# EAGLE design SDISK2_V0.3 (EAGLE 7.6.0)
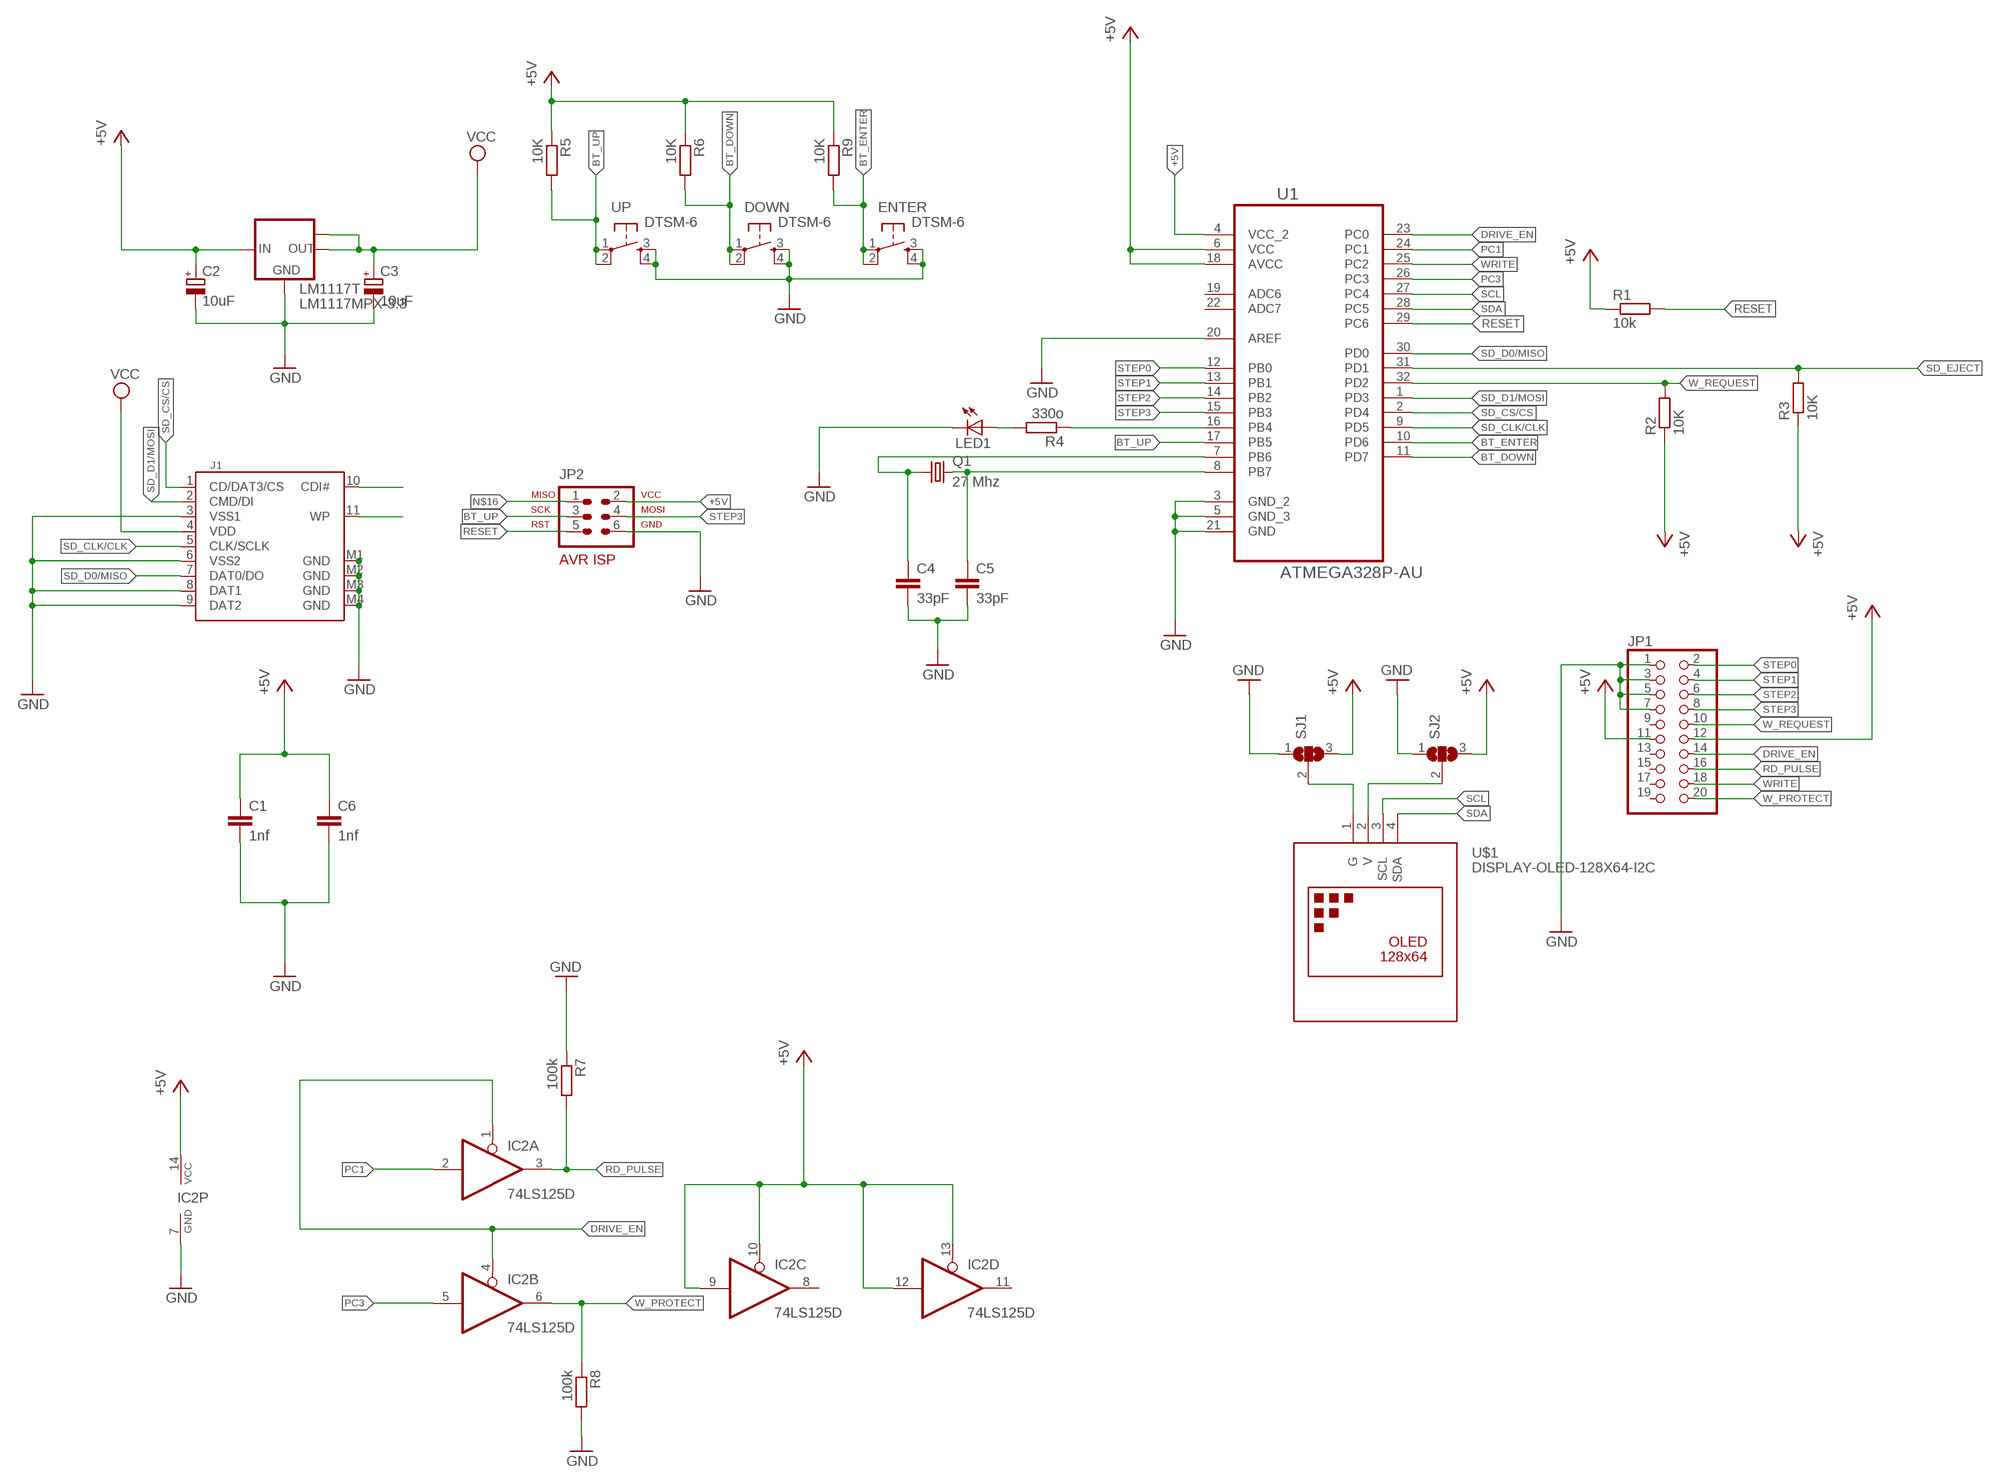
[diagram p0: schematic, sheet 1]

## Parts
C1  1nf  C-EUC0805  [C0805]
C2  10uF  CPOL-EU153CLV-0405  [153CLV-0405]
C3  10uF  CPOL-EU153CLV-0405  [153CLV-0405]
C4  33pF  C-EUC0805  [C0805]
C5  33pF  C-EUC0805  [C0805]
C6  1nf  C-EUC0805  [C0805]
DOWN  DTSM-6  [DTSM-6]
ENTER  DTSM-6  [DTSM-6]
IC2  74LS125D  [SO14]
J1  SDCARD  [SDCMF-10915W010]
JP1  PINHD-2X10_IDC2X10_IDC_NEW  [2X10_IDC]
JP2  AVR-ISP-6VERT  [AVR-ISP-6]
LED1  LEDSML1206  [SML1206]
LM1117T  LM1117MPX-3.3  [SOT223]
Q1  27 Mhz  CRYSTALHC49UP  [HC49UP]
R1  10k  R-EU_R0805  [R0805]
R2  10K  R-EU_R0805  [R0805]
R3  10K  R-EU_R0805  [R0805]
R4  330o  R-EU_R0805  [R0805]
R5  10K  R-EU_R0805  [R0805]
R6  10K  R-EU_R0805  [R0805]
R7  100k  R-EU_R0805  [R0805]
R8  100k  R-EU_R0805  [R0805]
R9  10K  R-EU_R0805  [R0805]
SJ1  SJ2W  [SJ_2]
SJ2  SJ2W  [SJ_2]
U1  ATMEGA328P-AU  [QFP80P900X900X120-32N]
U$1  DISPLAY-OLED-128X64-I2C  [DISPLAY-OLED-128X64-I2C]
UP  DTSM-6  [DTSM-6]

## Nets
3.3V: C3.+ J1.4(VDD) LM1117T.2(OUT) LM1117T.TAB(OUT1) ; supply symbol labelled VCC
+5V: C1.1 C2.+ C6.1 IC2.9(C:I) IC2.10(C:OE) IC2.12(D:I) IC2.13(D:OE) IC2.14(P:VCC) JP1.11 JP1.12 JP2.2 LM1117T.3(IN) R1.1 R2.1 R3.1 R5.1 R6.1 R9.1 SJ1.3 SJ2.3 U1.4(VCC_2) U1.6(VCC) U1.18(AVCC)
BT_DOWN: DOWN.1 DOWN.2 R6.2 U1.11(PD7)
BT_ENTER: ENTER.1 ENTER.2 R9.2 U1.10(PD6)
BT_UP: JP2.3 R5.2 U1.17(PB5) UP.1 UP.2
DRIVE_EN: IC2.1(A:OE) IC2.4(B:OE) JP1.14 U1.23(PC0)
GND: C1.2 C2.- C3.- C4.2 C5.2 C6.2 DOWN.3 DOWN.4 ENTER.3 ENTER.4 IC2.7(P:GND) J1.3(VSS1) J1.6(VSS2) J1.8(DAT1) J1.9(DAT2) J1.M1(GND) J1.M2(GND) J1.M3(GND) J1.M4(GND) JP1.1 JP1.3 JP1.5 JP1.7 JP2.6 LED1.C LM1117T.1(GND) R7.1 R8.2 SJ1.1 SJ2.1 U1.3(GND_2) U1.5(GND_3) U1.20(AREF) U1.21(GND) UP.3 UP.4
N$1: C4.1 Q1.1 U1.7(PB6)
N$2: LED1.A R4.2
N$3: J1.10(CDI#)
N$4: J1.11(WP)
N$7: SJ1.2 U$1.1(G)
N$8: SJ2.2 U$1.2(V)
N$16: JP2.1 R4.1 U1.16(PB4)
N$19: C5.1 Q1.2 U1.8(PB7)
PC1: IC2.2(A:I) U1.24(PC1)
PC3: IC2.5(B:I) U1.26(PC3)
RD_PULSE: IC2.3(A:O) JP1.16 R7.2
RESET: JP2.5 R1.2 U1.29(PC6)
SCL: U1.27(PC4) U$1.3(SCL)
SD_CLK/CLK: J1.5(CLK/SCLK) U1.9(PD5)
SD_CS/CS: J1.1(CD/DAT3/CS) U1.2(PD4)
SD_D0/MISO: J1.7(DAT0/DO) U1.30(PD0)
SD_D1/MOSI: J1.2(CMD/DI) U1.1(PD3)
SD_EJECT: R3.2 U1.31(PD1)
SDA: U1.28(PC5) U$1.4(SDA)
STEP0: JP1.2 U1.12(PB0)
STEP1: JP1.4 U1.13(PB1)
STEP2: JP1.6 U1.14(PB2)
STEP3: JP1.8 JP2.4 U1.15(PB3)
W_PROTECT: IC2.6(B:O) JP1.20 R8.1
W_REQUEST: JP1.10 R2.2 U1.32(PD2)
WRITE: JP1.18 U1.25(PC2)
Unconnected: IC2.8(C:O) IC2.11(D:O) JP1.9 JP1.13 JP1.15 JP1.17 JP1.19 U1.19(ADC6) U1.22(ADC7)

## Library data of the parts
C1 C4-C6 = rcl:C-EU: CAPACITOR, European symbol
C2 C3 = rcl:CPOL-EU: POLARIZED CAPACITOR, European symbol
DOWN ENTER UP = switch-tact:DTSM-6
IC2 = 74xx-eu:74*125: Quad bus BUFFER, 3-state
J1 = sd-mmc:SDCARD: SD card connector KINGFONT SDCMF-10915W010
JP1 = pinhead - Modified:PINHD-2X10_IDC: PIN HEADER
JP2 = avr-7:AVR-ISP-6: AVR ISP-6 Serial Programming Header
LED1 = led:LED: LED OSRAM: - CHIPLED LG R971, LG N971, LY N971, LG Q971, LY Q971, LO R971, LY R971 LH N974, LH R974 LS Q976, LO Q976, LY Q976 LO Q996 - Hyper CHIPLED LW Q18S LB Q993, LB Q99A, LB R99A - SideLED LS A670, LO A670, LY A670, LG A670, LP A670 LB A673, LV A673, LT A673, LW A673 LH A674 LY A675 LS A676, LA A676, LO A676, LY A676, LW A676 LS A679, LY A679, LG A679 - Hyper Micro SIDELED® LS Y876, LA Y876, LO Y876, LY Y876 LT Y87S - SmartLED LW L88C, LW L88S LB L89C, LB L89S, LG L890 LS L89K, LO L89K, LY L89K LS L896, LA L896, LO L896, LY L896 - TOPLED LS T670, LO T670, LY T670, LG T670, LP T670 LSG T670, LSP T670, LSY T670, LOP T670, LYG T670 LG T671, LOG T671, LSG T671 LB T673, LV T673, LT T673, LW T673 LH T674 LS T676, LA T676, LO T676, LY T676, LB T676, LH T676, LSB T676, LW T676 LB T67C, LV T67C, LT T67C, LS T67K, LO T67K, LY T67K, LW E67C LS E67B, LA E67B, LO E67B, LY E67B, LB E67C, LV E67C, LT E67C LW T67C LS T679, LY T679, LG T679 LS T770, LO T770, LY T770, LG T770, LP T770 LB T773, LV T773, LT T773, LW T773 LH T774 LS E675, LA E675, LY E675, LS T675 LS T776, LA T776, LO T776, LY T776, LB T776 LHGB T686 LT T68C, LB T68C - Hyper Mini TOPLED® LB M676 - Mini TOPLED Santana® LG M470 LS M47K, LO M47K, LY M47K Source: http://www.osram.convergy.de LUXEON: - LUMILED® LXK2-PW12-R00, LXK2-PW12-S00, LXK2-PW14-U00, LXK2-PW14-V00 LXK2-PM12-R00, LXK2-PM12-S00, LXK2-PM14-U00 LXK2-PE12-Q00, LXK2-PE12-R00, LXK2-PE12-S00, LXK2-PE14-T00, LXK2-PE14-U00 LXK2-PB12-K00, LXK2-PB12-L00, LXK2-PB12-M00, LXK2-PB14-N00, LXK2-PB14-P00, LXK2-PB14-Q00 LXK2-PR12-L00, LXK2-PR12-M00, LXK2-PR14-Q00, LXK2-PR14-R00 LXK2-PD12-Q00, LXK2-PD12-R00, LXK2-PD12-S00 LXK2-PH12-R00, LXK2-PH12-S00 LXK2-PL12-P00, LXK2-PL12-Q00, LXK2-PL12-R00 Source: www.luxeon.com KINGBRIGHT: KA-3528ASYC Source: www.kingbright.com
LM1117T = lm1117:LM1117MPX-*
Q1 = crystal:CRYSTAL: CRYSTAL; OC_FARNELL: unknown; OC_NEWARK: unknown
R1-R9 = resistor:R-EU_: RESISTOR, European symbol
SJ1 SJ2 = jumper:SJ2W: SMD solder JUMPER
U1 = Atmel_By_element14_Batch_1-00:ATMEGA328P-AU: 8-bit Microcontroller with In-System Programmable Flash; MPN: ATMEGA328P-AU; OC_FARNELL: 1715486; OC_NEWARK: 14R4631; PACKAGE: TQFP-32; SUPPLIER: Atmel
U$1 = diy-modulesCUSTOM:DISPLAY-OLED-128X64-I2C: 128x64 Dot Matrix OLED Module based on SSD1306 chip Variant with I2C interface More details available here: http://www.instructables.com/id/Monochrome-096-i2c-OLED-display-with-arduino-SSD13/ SSD1306 datasheet: https://cdn-shop.adafruit.com/datasheets/SSD1306.pdf Click here to find device on ebay.com <http://www.ebay.com/sch/oled+display+128x64+iic> Note: There are two variants: I2C and SPI. Search for the proper version.

## Net classes
1 VCC: width 0.508 mm

## Board
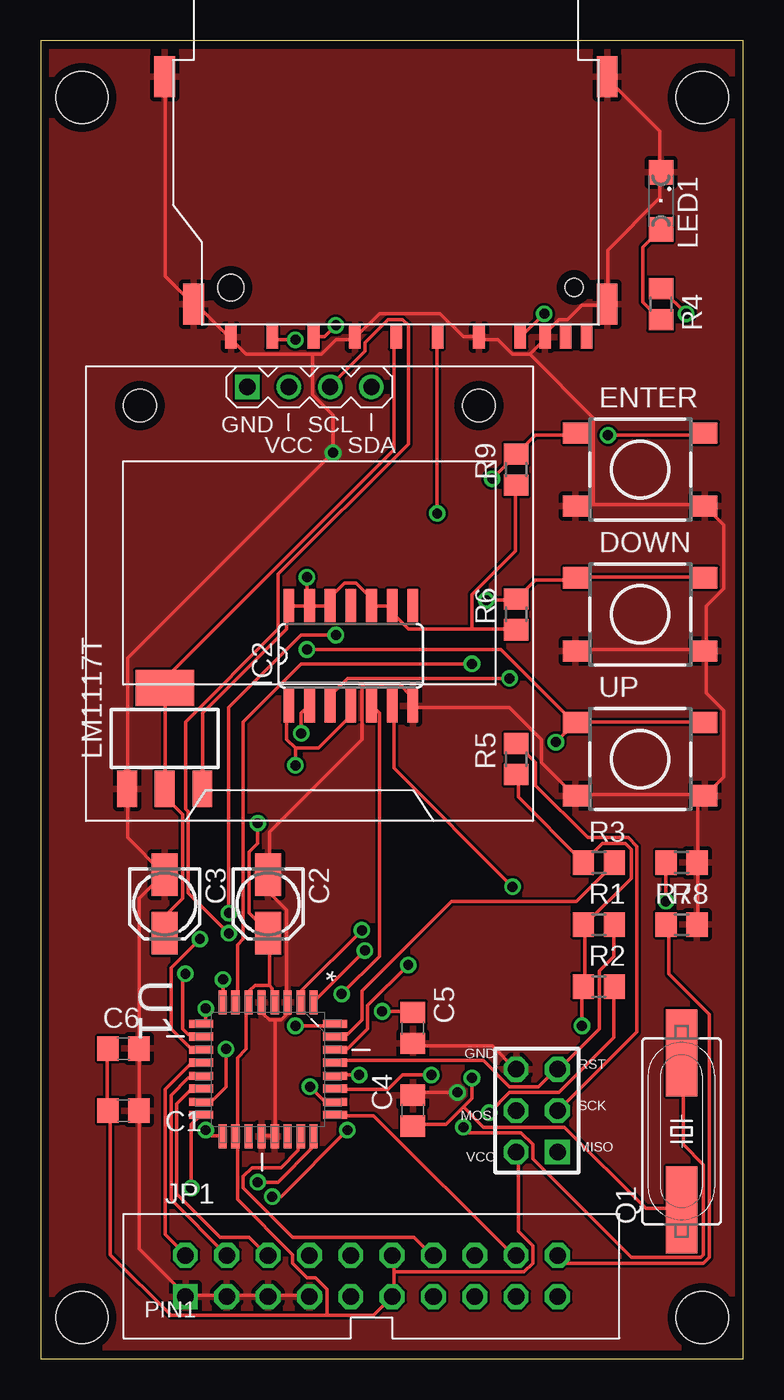
[diagram p1: board, top side]
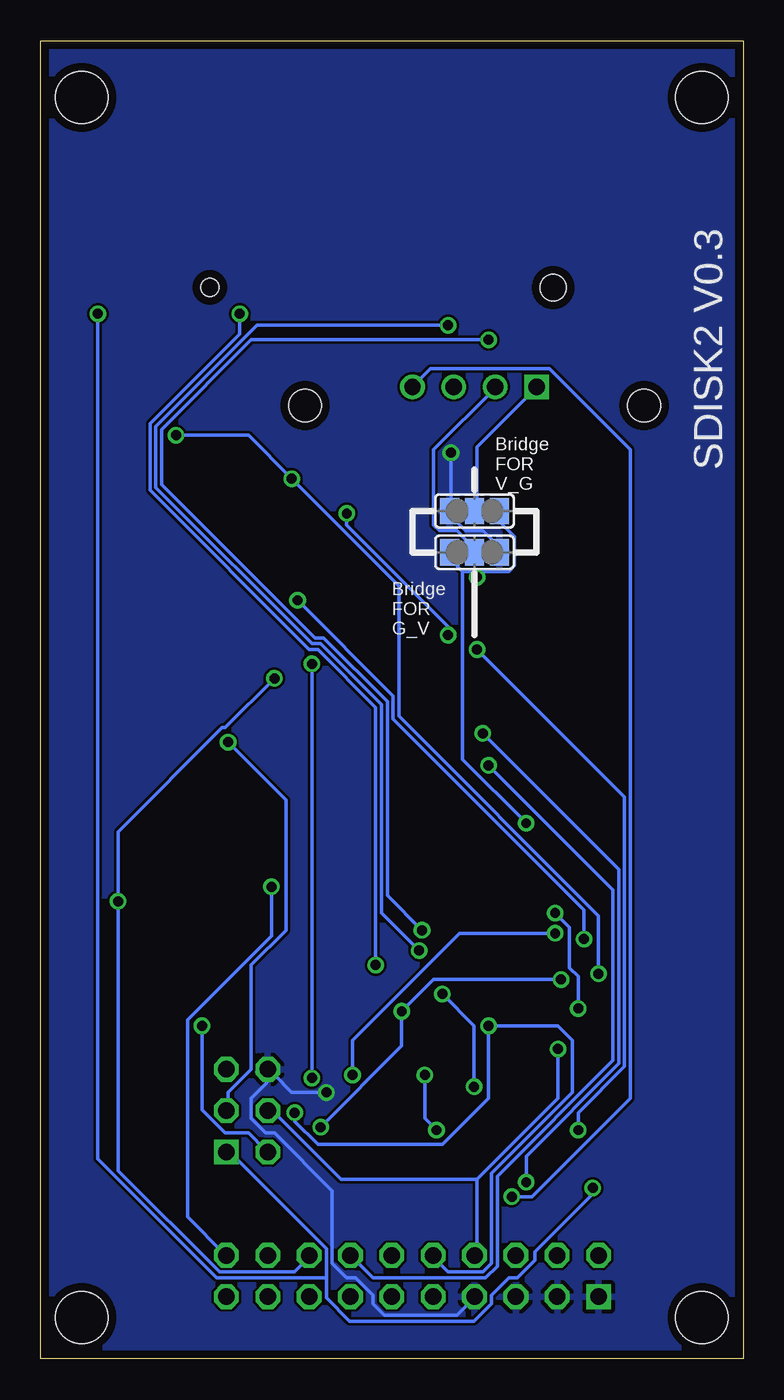
[diagram p2: board, bottom side, seen from below]

Size 43.16 x 80.95 mm. Coordinates in mm from the lower left corner, seen from the top.
Outline: 0,0 43.16,0 43.16,80.95 0,80.95 0,0
Copper layers (1*16): Top 0.035mm / dielectric 1.5mm / Bottom 0.035mm
Design rules "default *": minimum track width 8mil, minimum drill 24mil, track to track 6mil, track to pad 6mil, pad to pad 6mil, via to via 6mil, smd to smd 8mil, copper to edge 20mil, drill to drill 8mil, minimum pad ring 10mil, minimum via ring 8mil, stop-mask expansion 4mil, vias tented up to drill 0mil, thermal gap 10mil
Holes 3.2 mm at 2.54,77.47 40.64,77.47 2.54,2.54 40.64,2.54

### Footprints (pad centres in the part's own frame; a part is rotated, then mirrored left to right if it is on the bottom)
C0805 = smd 1.3 x 1.5: 1 -0.95,0; 2 0.95,0
153CLV-0405 = smd 2.6 x 1.6: + 1.8,0; - -1.8,0
DTSM-6 = smd 1.55 x 1.3: 1 -3.975,2.25; 2 3.975,2.25; 3 -3.975,-2.25; 4 3.975,-2.25
SO14 = smd 0.66 x 2.032: 1 -3.81,-3.073; 2 -2.54,-3.073; 3 -1.27,-3.073; 4 0,-3.073; 5 1.27,-3.073; 6 2.54,-3.073; 7 3.81,-3.073; 8 3.81,3.073; 9 2.54,3.073; 10 1.27,3.073; 11 0,3.073; 12 -1.27,3.073; 13 -2.54,3.073; 14 -3.81,3.073
SDCMF-10915W010 = smd 0.711 x 1.422: 1 7.366,13.462; 2 4.826,13.462; 3 2.286,13.462; 4 -0.254,13.462; 5 -2.794,13.462; 6 -5.334,13.462; 7 -7.874,13.462; 8 -9.398,13.462; 9 9.906,13.462; 10 -11.938,13.462; 11 -10.668,13.462 | smd 1.27 x 2.54: M1 12.192,11.43; M2 13.97,-2.54; M3 -13.208,-2.54; M4 -13.208,11.43 | hole 1.6: 9.906,10.414 | hole 1.1: -11.176,10.414
2X10_IDC = drill 1.016 square: 1 -11.43,-1.27 | drill 1.016 octagon: 2 -11.43,1.27; 3 -8.89,-1.27; 4 -8.89,1.27; 5 -6.35,-1.27; 6 -6.35,1.27; 7 -3.81,-1.27; 8 -3.81,1.27; 9 -1.27,-1.27; 10 -1.27,1.27; 11 1.27,-1.27; 12 1.27,1.27; 13 3.81,-1.27; 14 3.81,1.27; 15 6.35,-1.27; 16 6.35,1.27; 17 8.89,-1.27; 18 8.89,1.27; 19 11.43,-1.27; 20 11.43,1.27
AVR-ISP-6 = drill 1.016 square: 1 -2.54,-1.27 | drill 1.016 octagon: 2 -2.54,1.27; 3 0,-1.27; 4 0,1.27; 5 2.54,-1.27; 6 2.54,1.27
SML1206 = smd 1.5 x 1.5: A 1.75,0; C -1.75,0
SOT223 = smd 1.219 x 2.235: 1 -2.311,-3.099; 2 0,-3.099; 3 2.311,-3.099 | smd 3.6 x 2.2: TAB 0,3.099
HC49UP = smd 5.334 x 1.93: 1 -4.826,0; 2 4.826,0
R0805 = smd 1.3 x 1.5: 1 -0.95,0; 2 0.95,0
SJ_2 = smd 1.168 x 1.6: 1 -1.524,0; 2 0,0; 3 1.524,0
QFP80P900X900X120-32N = smd 1.473 x 0.508: 1 -4.115,2.794; 2 -4.115,2.007; 3 -4.115,1.194; 4 -4.115,0.406; 5 -4.115,-0.406; 6 -4.115,-1.194; 7 -4.115,-2.007; 8 -4.115,-2.794; 17 4.115,-2.794; 18 4.115,-2.007; 19 4.115,-1.194; 20 4.115,-0.406; 21 4.115,0.406; 22 4.115,1.194; 23 4.115,2.007; 24 4.115,2.794 | smd 0.508 x 1.473: 9 -2.794,-4.115; 10 -2.007,-4.115; 11 -1.194,-4.115; 12 -0.406,-4.115; 13 0.406,-4.115; 14 1.194,-4.115; 15 2.007,-4.115; 16 2.794,-4.115; 25 2.794,4.115; 26 2.007,4.115; 27 1.194,4.115; 28 0.406,4.115; 29 -0.406,4.115; 30 -1.194,4.115; 31 -2.007,4.115; 32 -2.794,4.115
DISPLAY-OLED-128X64-I2C = drill 1 square: 1 -3.81,12.7 | drill 1: 2 -1.27,12.7; 3 1.27,12.7; 4 3.81,12.7 | hole 2: -10.414,11.557; 10.414,11.557

### Placement (x,y rotation side)
C1  5.08,15.24 0 top
C2  13.97,27.94 270 top
C3  7.62,27.94 270 top
C4  22.86,15.24 90 top
C5  22.86,20.32 270 top
C6  5.08,19.05 0 top
DOWN  36.83,45.72 0 top
ENTER  36.83,54.61 0 top
IC2  19.05,43.18 0 top
J1  21.59,76.2 180 top
JP1  20.32,5.08 0 top
JP2  30.48,15.24 90 top
LED1  38.1,71.12 270 top
LM1117T  7.62,38.1 0 top
Q1  39.37,13.97 90 top
R1  34.29,26.67 0 top
R2  34.29,22.86 0 top
R3  34.29,30.48 0 top
R4  38.1,64.77 270 top
R5  29.21,36.83 90 top
R6  29.21,45.72 90 top
R7  39.37,30.48 180 top
R8  39.37,26.67 0 top
R9  29.21,54.61 90 top
SJ1  16.51,52.07 0 bottom
SJ2  16.51,49.53 180 bottom
U1  13.97,17.78 270 top
U$1  16.51,46.99 0 top
UP  36.83,36.83 0 top

### Tracks (layer width: path | path; a pad name or v marks a point on that pad's centre or on a via)
3.3V
  Top 0.203: J1.4 21.69,62.59 21.69,55.83 7.64,41.78 7.64,41.25 LM1117T.TAB 7.64,41.07 7.64,35.03 LM1117T.2 7.64,34.85 7.64,34.49 8.71,33.43 8.71,28.27 7.64,27.2 7.64,26.31 C3.+
+5V  (via drill 0.61)
  Top 0.203: 26.49,44.81 22.58,44.81 21.69,45.7 21.69,46.23 IC2.9 21.51,46.23 20.45,46.23 IC2.10 20.27,46.41 20.27,46.76 19.38,47.65 18.67,47.65 17.78,46.76 IC2.12 17.78,46.23 16.54,46.23 IC2.13 | 26.49,44.81 29.16,44.81 R6.1 | 26.49,44.81 26.49,46.94 29.16,49.61 29.16,53.52 R9.1 | IC2.13 16.36,46.23 15.29,46.23 IC2.14 15.11,46.23 15.11,44.81 9.96,39.65 9.96,35.03 LM1117T.3 | v16.36,48.01 16.36,46.41 IC2.13 | 33.43,26.67 33.43,22.94 R2.1 33.25,22.76 v33.25,20.45 | R5.1 29.34,35.74 29.34,34.49 33.25,30.58 R3.1 33.43,30.58 34.49,31.65 35.92,31.65 36.27,31.29 36.27,29.52 33.43,26.67 | 33.43,26.67 R1.1 | 14.05,22.94 14.22,22.76 14.22,22.05 U1.4 | 14.05,22.94 13.16,22.94 12.8,22.58 12.8,22.05 U1.6 12.62,21.87 12.62,19.02 12.09,18.49 12.09,13.69 U1.18 12.09,13.51 12.09,9.78 15.47,6.4 15.47,5.87 16.36,4.98 16.89,4.98 17.6,4.27 17.6,2.67 | 14.05,22.94 14.05,26.14 C2.+ 13.87,26.31 12.8,27.38 12.8,31.11 13.34,31.65 v13.34,32.89 | C6.1 4.09,19.02 4.09,15.29 C1.1 4.27,15.11 4.27,6.4 8,2.67 17.6,2.67 | 17.6,2.67 20.45,2.67 JP1.11 21.69,3.91 21.69,5.33 | 21.69,5.33 21.69,6.22 JP1.12 | 21.69,5.33 29.69,5.33 30.23,5.87 30.23,6.93 29.34,7.82 29.34,12.62 JP2.2
  Bottom 0.203: 17.25,48.36 16.36,48.36 | 16.36,48.36 14.4,48.36 14.05,48.72 14.05,50.49 14.94,51.38 14.94,51.92 SJ1.3 | 17.25,48.36 17.96,49.07 17.96,49.43 SJ2.3 | v16.36,48.01 16.36,48.36 | v33.25,20.45 33.25,15.29 31.83,13.87 30.4,13.87 29.34,12.8 JP2.2 | 17.25,48.36 17.25,36.8 v13.34,32.89
BT_DOWN  (via drill 0.61)
  Top 0.203: v9.78,25.78 8,24 8,20.27 9.25,19.02 9.78,19.02 U1.11 | v27.38,46.58 29.16,46.58 R6.2 29.34,46.76 30.4,47.83 32.72,47.83 DOWN.1 32.89,48.01 40.72,48.01 DOWN.2
  Bottom 0.203: v9.78,25.78 9.78,27.56 21.51,39.29 21.51,40.72 v27.38,46.58
BT_ENTER  (via drill 0.61)
  Top 0.203: v8.89,23.65 8.71,23.47 8.71,20.27 9.07,19.91 9.78,19.91 U1.10 | v27.74,54.05 29.16,55.47 R9.2 29.34,55.65 30.4,56.72 32.72,56.72 ENTER.1 | v34.85,56.72 40.72,56.72 ENTER.2
  Bottom 0.203: v8.89,23.65 8.89,27.2 21.16,39.47 21.16,47.47 v27.74,54.05 30.4,56.72 v34.85,56.72
BT_UP  (via drill 0.61)
  Top 0.203: R5.2 29.34,37.69 30.4,36.63 30.4,35.2 33.6,32 36.09,32 36.63,31.47 36.63,20.09 31.83,15.29 JP2.3 | v10.13,14.05 10.49,13.69 11.02,13.69 U1.17 | v16.36,43.56 28.27,43.56 32.72,39.12 UP.1 | UP.2 40.72,39.12 32.89,39.12 UP.1 | v31.65,37.87 32.72,38.94 UP.1
  Bottom 0.203: v10.13,14.05 10.13,15.11 7.29,17.96 7.29,34.49 v16.36,43.56 | v31.65,37.87 28.09,34.31 28.09,26.31 30.23,24.18 30.23,17.78 31.65,16.36 31.65,15.29 JP2.3
DRIVE_EN  (via drill 0.61)
  Top 0.203: 15.65,37.52 15.11,38.05 15.11,40.01 IC2.1 | 15.65,37.52 17.07,37.52 19.02,39.47 19.02,40.01 IC2.4 | U1.23 15.82,13.51 15.82,12.8 14.76,11.73 12.98,11.73 12.45,11.2 12.45,10.49 15.47,7.47 22.94,7.47 24,6.4 JP1.14 | v15.65,36.45 15.65,37.52
  Bottom 0.203: v15.65,36.45 8,28.8 8,18.31 15.11,11.2 15.11,5.69 15.82,4.98 22.76,4.98 JP1.14
GND  (via drill 0.61)
  Top 0.203: U1.20 13.69,13.69 14.22,13.69 U1.21 14.4,13.69 14.4,20.8 | 14.4,20.8 14.76,20.8 15.11,21.16 15.11,21.87 U1.3 15.11,22.05 15.11,27.56 14.05,28.63 14.05,29.69 C2.- 14.05,29.87 14.05,32.36 19.74,38.05 19.74,41.25 19.91,41.43 22.05,41.43 22.76,40.72 22.76,40.18 IC2.7 22.94,40.01 28.8,40.01 30.76,38.05 30.76,36.63 32.72,34.67 UP.3 32.89,34.67 40.36,34.67 | 14.4,20.8 14.05,20.8 13.69,21.16 13.69,21.87 U1.5 | DOWN.3 32.89,43.56 40.72,43.56 DOWN.4 | 33.96,52.45 40.72,52.45 ENTER.4 40.89,52.27 41.96,51.21 41.96,47.3 40.89,46.23 40.89,43.56 DOWN.4 | 33.96,52.45 32.89,52.45 ENTER.3 | R8.2 40.36,26.67 40.36,30.4 R7.1 40.36,30.58 40.36,34.67 | 40.36,34.67 40.72,34.67 UP.4 | 40.36,34.67 UP.4 | DOWN.4 40.89,43.38 40.89,40.89 41.96,39.83 41.96,35.74 40.89,34.67 UP.4 | v25.6,16.36 22.94,16.36 C4.2 | C5.2 22.94,19.2 27.74,19.2 29.16,17.78 JP2.6 | 8.89,3.91 11.38,3.91 JP1.3 11.56,3.91 13.87,3.91 JP1.5 14.05,3.91 16.36,3.91 JP1.7 | 8.89,3.91 6.04,6.76 6.04,15.11 C1.2 6.04,15.29 6.04,19.02 C6.2 6.04,19.2 6.04,28.27 7.47,29.69 C3.- 7.47,29.87 5.33,32 5.33,34.85 LM1117T.1 5.33,35.03 5.33,43.03 v17.96,55.65 17.96,57.96 16.71,59.21 16.71,61.7 | 8.89,3.91 JP1.1 | J1.M3 34.85,78.59 38.05,75.39 38.05,72.9 LED1.C 38.05,72.72 38.05,71.3 34.85,68.1 34.85,64.9 J1.M4 34.67,64.72 33.25,64.72 32.36,63.83 31.83,63.83 31.11,63.12 31.11,62.76 J1.8 30.94,62.59 30.05,61.7 | 30.05,61.7 28.98,61.7 28.09,62.59 27.03,62.59 J1.6 26.85,62.76 25.96,62.76 24.54,64.19 20.8,64.19 19.38,62.76 J1.3 19.2,62.59 18.14,62.59 17.25,61.7 16.71,61.7 | 16.71,61.7 12.62,61.7 11.73,62.59 J1.9 11.56,62.76 9.42,64.9 J1.M1 9.25,64.9 7.64,66.5 7.64,78.59 J1.M2
  Top 0.203: 33.96,52.45 33.96,57.78 30.05,61.7
  Bottom 0.203: v25.6,16.36 27.74,16.36 28.8,17.42 | 28.8,17.42 29.16,17.78 JP2.6 28.8,17.42 | 28.8,17.42 30.23,16 30.23,14.76 29.34,13.87 28.8,13.87 25.25,10.31 25.25,5.87 24.36,4.98 23.82,4.98 22.76,3.91 22.76,3.38 22.05,2.67 17.6,2.67 16.54,3.73 JP1.7 | SJ2.1 15.11,49.61 15.11,49.96 16,50.85 17.07,50.85 18.14,51.92 SJ1.1 17.96,52.09 v17.96,55.65
  pour Top: 0,81.28 43.18,81.28 43.18,0 0,0
  pour Bottom: 0,81.28 43.18,81.28 43.18,0 0,0
N$1  (via drill 0.61)
  Top 0.203: v26.49,42.67 16,42.67 12.45,39.12 12.45,25.78 12.09,25.43 12.09,22.05 U1.7 | v26.49,17.25 26.49,16 25.96,15.47 | 25.96,15.47 24.89,14.4 22.94,14.4 C4.1 | 25.96,15.47 27.2,14.22 32.18,14.22 37.16,9.25 39.29,9.25 Q1.1
  Bottom 0.203: v26.49,17.25 v26.49,42.67
N$2
  Top 0.203: R4.2 38.05,63.83 36.98,64.9 36.98,68.28 38.05,69.34 LED1.A
N$7
  Bottom 0.203: SJ1.2 16.36,52.09 16.36,56.01 12.8,59.56 U$1.1
N$8
  Bottom 0.203: SJ2.2 16.54,49.61 17.07,50.14 17.07,50.32 17.6,50.85 18.67,50.85 19.02,51.21 19.02,55.83 15.29,59.56 U$1.2
N$16  (via drill 0.61)
  Top 0.203: v9.25,10.49 9.25,14.4 9.78,14.94 U1.16 | v39.65,64.19 38.23,65.61 R4.1
  Bottom 0.203: v9.25,10.49 9.25,10.13 12.8,6.58 12.8,6.04 13.87,4.98 14.4,4.98 15.47,3.91 15.47,3.38 16.54,2.31 24.18,2.31 25.6,3.73 25.6,4.98 | 25.6,4.98 25.6,6.76 31.65,12.8 JP2.1 | v39.65,64.19 39.65,12.27 32.36,4.98 25.6,4.98
N$19  (via drill 0.61)
  Top 0.203: v11.2,23.29 11.2,22.05 U1.8 | v20.98,21.34 22.76,21.34 C5.1 | v25.96,14.22 26.31,13.87 29.52,13.87 30.23,13.16 30.23,12.27 36.27,6.22 40.54,6.22 40.72,6.4 40.72,11.91 39.47,13.16 39.47,18.67 Q1.2
  Bottom 0.203: v11.2,23.29 19.02,23.29 v20.98,21.34 20.98,19.2 v25.96,14.22
PC1  (via drill 0.61)
  Top 0.203: v13.34,10.85 14.58,10.85 16.71,12.98 16.71,13.51 U1.24 | v16,38.41 16,39.65 16.36,40.01 IC2.2
  Bottom 0.203: v13.34,10.85 13.34,12.45 7.64,18.14 7.64,30.05 v16,38.41
PC3  (via drill 0.61)
  Top 0.203: v16.54,16.71 17.42,15.82 17.96,15.82 U1.26 | v18.49,22.4 20.8,24.71 20.8,39.65 20.45,40.01 IC2.5
  Bottom 0.203: v16.54,16.71 16.54,20.45 v18.49,22.4
RD_PULSE  (via drill 0.61)
  Top 0.203: v38.41,28.09 38.41,30.4 R7.2 | IC2.3 17.78,40.72 18.85,41.78 v28.8,41.78
  Bottom 0.203: JP1.16 26.67,6.22 27.56,5.33 32.18,5.33 38.41,11.56 v38.41,28.09 38.41,32.36 32,38.76 31.83,38.76 v28.8,41.78
RESET
  Top 0.203: U1.29 18.14,18.31 27.2,18.31 28.8,16.71 30.58,16.71 31.65,17.78 JP2.5 31.83,17.78 34.31,20.27 34.31,23.82 35.2,24.71 35.2,26.67 R1.2
SCL  (via drill 0.61)
  Top 0.203: v24,17.42 22.23,17.42 21.34,16.54 18.14,16.54 U1.27 | v11.56,26.14 9.07,28.63 9.07,33.6 8.89,33.78 8.89,39.12 14.58,44.81 14.58,48.18 22.58,56.19 22.58,63.48 22.23,63.83 21.34,63.83 19.91,62.41 19.91,61.87 17.78,59.74 U$1.3
  Bottom 0.203: v24,17.42 24,19.56 17.42,26.14 v11.56,26.14
SD_CLK/CLK  (via drill 0.61)
  Top 0.203: v24.36,51.92 24.36,62.59 J1.5 | v18.14,44.45 16,44.45 11.56,40.01 v11.56,27.38 | v10.13,21.51 10.13,20.8 9.96,20.62 U1.9
  Bottom 0.203: v24.36,51.92 24.36,51.21 18.14,44.98 v18.14,44.45 | v11.56,27.38 10.67,26.49 10.67,24 10.13,23.47 v10.13,21.51
SD_CS/CS  (via drill 0.61)
  Top 0.203: v15.65,62.59 14.22,62.59 J1.1 | v19.74,26.31 16,22.58 16,22.05 U1.2
  Bottom 0.203: v15.65,62.59 30.23,62.59 35.74,57.07 35.74,53.7 26.31,44.27 25.78,44.27 21.87,40.36 21.87,28.45 v19.74,26.31
SD_D0/MISO  (via drill 0.61)
  Top 0.203: v30.94,64.19 29.52,62.76 J1.7 | v22.58,24.18 20.09,21.69 20.09,20.27 18.85,19.02 18.14,19.02 U1.30
  Bottom 0.203: v30.94,64.19 30.94,62.94 36.45,57.43 36.45,53.34 26.67,43.56 26.14,43.56 22.58,40.01 v22.58,24.18
SD_D1/MOSI  (via drill 0.61)
  Top 0.203: v18.14,63.48 17.42,62.76 16.89,62.76 J1.2 | v19.91,25.07 16.89,22.05 U1.1
  Bottom 0.203: v18.14,63.48 29.87,63.48 36.09,57.25 36.09,53.52 26.49,43.92 25.96,43.92 22.23,40.18 22.23,27.38 v19.91,25.07
SD_EJECT
  Top 0.203: U1.31 18.14,19.91 18.85,19.91 19.74,20.8 19.74,22.58 25.25,28.09 32.89,28.09 35.2,30.4 R3.2
SDA  (via drill 0.61)
  Top 0.203: v19.56,17.42 18.14,17.42 U1.28 | v18.85,14.05 14.76,9.96 v14.22,9.96
  Bottom 0.203: v19.56,17.42 19.56,14.76 v18.85,14.05 | v14.22,9.96 12.98,9.96 6.93,16 6.93,55.83 11.91,60.81 19.2,60.81 U$1.4
STEP0
  Top 0.203: U1.12 9.78,18.14 9.25,18.14 7.64,16.54 7.64,7.64 8.89,6.4 JP1.2
STEP1
  Top 0.203: JP1.4 8,9.78 8,16.18 9.07,17.25 9.78,17.25 U1.13
STEP2
  Top 0.203: U1.14 9.78,16.54 9.25,16.54 8.36,15.65 8.36,10.13 11.02,7.47 12.8,7.47 13.87,6.4 JP1.6
STEP3  (via drill 0.61)
  Top 0.203: v11.38,19.02 11.38,16.71 10.49,15.82 9.96,15.82 U1.15
  Bottom 0.203: v11.38,19.02 11.38,16 16.36,11.02 | 16.36,11.02 16.36,6.4 JP1.8 | 16.36,11.02 24.71,11.02 28.8,15.11 29.16,15.11 JP2.4
W_PROTECT  (via drill 0.61)
  Top 0.203: R8.1 38.58,26.67 38.58,23.65 41.07,21.16 41.07,6.22 40.72,5.87 32.18,5.87 31.83,6.22 JP1.20 | v28.98,28.98 21.69,36.27 21.69,40.01 IC2.6
  Bottom 0.203: v28.98,28.98 28.98,25.96 34.14,20.8 34.14,8.71 31.83,6.4 JP1.20
W_REQUEST  (via drill 0.61)
  Top 0.203: v15.65,20.45 17.96,20.45 U1.32 | v27.56,15.11 28.8,16.36 31.83,16.36 35.2,19.74 35.2,22.76 R2.2
  Bottom 0.203: JP1.10 19.02,6.22 18.14,5.33 16,5.33 15.47,5.87 15.47,11.38 10.49,16.36 10.49,19.56 11.38,20.45 v15.65,20.45 15.65,16 18.49,13.16 26.14,13.16 27.56,14.58 v27.56,15.11
WRITE
  Top 0.203: U1.25 18.14,14.94 20.45,14.94 29.16,6.22 JP1.18

### Text on the board
tNames: GND | RST | MOSI | SCK | VCC | MISO | PIN1
bNames: SDISK2 V0.3 | Bridge / FOR / V_G | Bridge / FOR / G_V